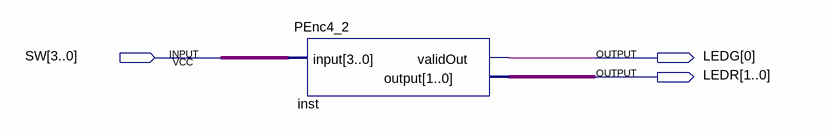
[diagram p0: schematic sheet]
// Quartus schematic PEnc4_2Demo.bdf as structural Verilog: 1 symbols, 3 pins
module PEnc4_2Demo (
  input  [3:0] SW,
  output [0:0] LEDG,
  output [1:0] LEDR
);

  PEnc4_2 inst (.\input (SW), .validOut(LEDG[0]), .\output (LEDR));
endmodule
